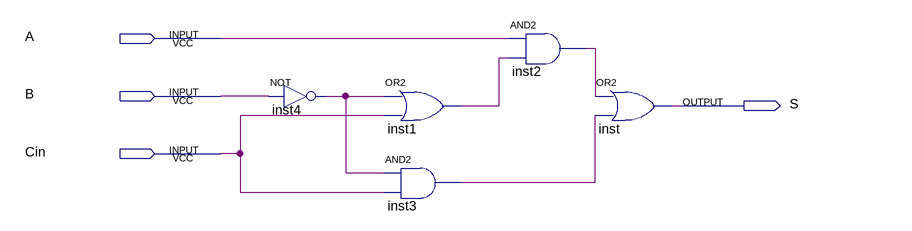
[diagram p0: schematic sheet]
// Quartus schematic Comparador_1bit.bdf as structural Verilog: 5 symbols, 4 pins
module Comparador_1bit (
  input  A,
  input  B,
  input  Cin,
  output S
);

  wire inst1_out, inst2_out, inst3_out, inst4_out;

  not inst4 (inst4_out, B);
  or inst1 (inst1_out, inst4_out, Cin);
  and inst3 (inst3_out, inst4_out, Cin);
  and inst2 (inst2_out, A, inst1_out);
  or inst (S, inst2_out, inst3_out);
endmodule
